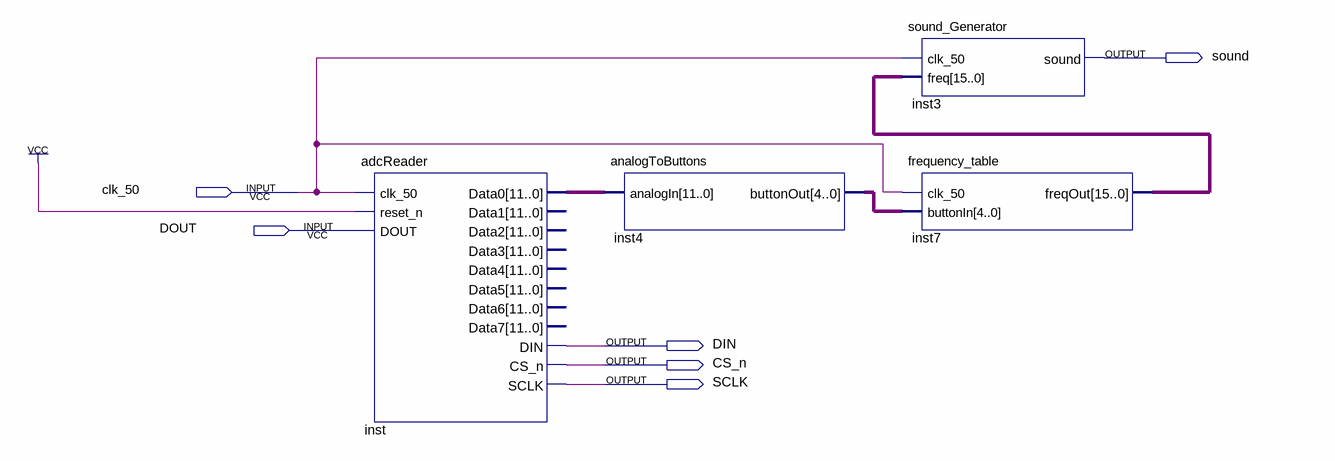
[diagram p0: schematic sheet]
// Quartus schematic different_sounds.bdf as structural Verilog: 4 symbols, 6 pins
module different_sounds (
  input  clk_50,
  input  DOUT,
  output sound,
  output DIN,
  output CS_n,
  output SCLK
);

  wire [4:0] inst4_buttonout;
  wire [11:0] inst_data0;
  wire [15:0] inst7_freqout;

  adcReader inst (
    .clk_50(clk_50), .reset_n(1'b1), .DOUT(DOUT), .Data0(inst_data0), .DIN(DIN), .CS_n(CS_n), .SCLK(SCLK));  // open: Data1, Data2, Data3, Data4, Data5, Data6, Data7
  analogToButtons inst4 (.analogIn(inst_data0), .buttonOut(inst4_buttonout));
  sound_Generator inst3 (.clk_50(clk_50), .freq(inst7_freqout), .sound(sound));
  frequency_table inst7 (.clk_50(clk_50), .buttonIn(inst4_buttonout), .freqOut(inst7_freqout));
endmodule
